# EAGLE schematic caps (EAGLE 6.5.0)
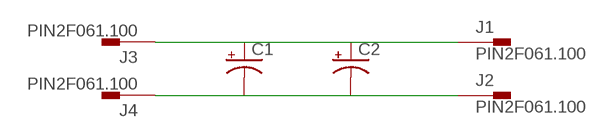
[diagram p0: schematic, sheet 1]

## Parts
C1  CPOL-USE10-35  [EB35D]
C2  CPOL-USE10-35  [EB35D]
J1  PIN2F061.100  [F061.100]
J2  PIN2F061.100  [F061.100]
J3  PIN2F061.100  [F061.100]
J4  PIN2F061.100  [F061.100]

## Nets
N$1: C1.+ C2.+ J1.A1 J1.A2 J3.A1 J3.A2
N$2: C1.- C2.- J2.A1 J2.A2 J4.A1 J4.A2

## Library data of the parts
C1 C2 = rcl:CPOL-US: POLARIZED CAPACITOR, American symbol
J1-J4 = con-faston:PIN2: Flachstecker Typ Tyco/Electronics/AMP TAB, FASTON Printed Circuit Board Tabs Source: http://www.buerklin.com, http://catalog.tycoelectronics.com; OC_FARNELL: unknown; OC_NEWARK: unknown